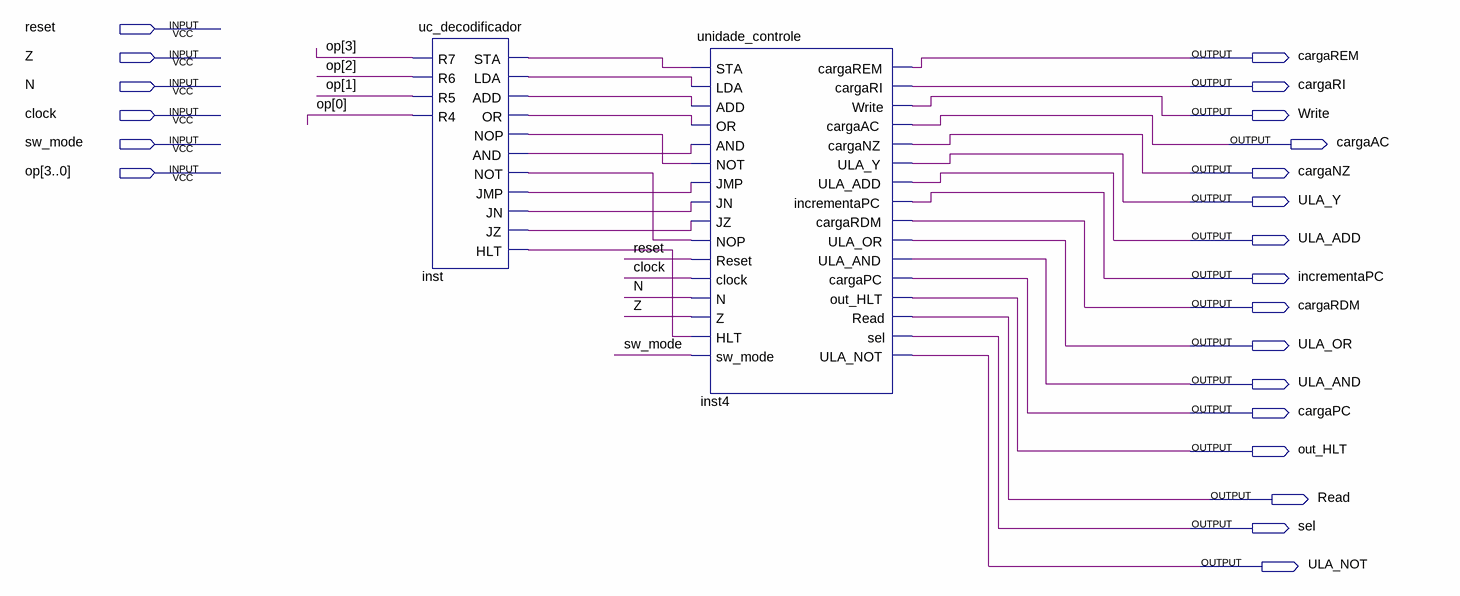
[diagram p0: schematic sheet]
// Quartus schematic lab_07.bdf as structural Verilog: 2 symbols, 22 pins
module lab_07 (
  input  reset,
  input  Z,
  input  N,
  input  clock,
  input  sw_mode,
  input  [3:0] op,
  output cargaREM,
  output cargaRI,
  output Write,
  output cargaAC,
  output cargaNZ,
  output ULA_Y,
  output ULA_ADD,
  output incrementaPC,
  output cargaRDM,
  output ULA_OR,
  output ULA_AND,
  output cargaPC,
  output out_HLT,
  output Read,
  output sel,
  output ULA_NOT
);

  wire inst_add, inst_and, inst_hlt, inst_jmp, inst_jn, inst_jz, inst_lda, inst_nop, inst_not, inst_or,
       inst_sta;

  uc_decodificador inst (
    .R7(op[3]), .R6(op[2]), .R5(op[1]), .R4(op[0]), .STA(inst_sta), .LDA(inst_lda), .ADD(inst_add),
    .OR(inst_or), .NOP(inst_nop), .AND(inst_and), .NOT(inst_not), .JMP(inst_jmp), .JN(inst_jn), .JZ(inst_jz),
    .HLT(inst_hlt));
  unidade_controle inst4 (
    .STA(inst_sta), .LDA(inst_lda), .ADD(inst_add), .OR(inst_or), .AND(inst_and), .NOT(inst_nop),
    .JMP(inst_jmp), .JN(inst_jn), .JZ(inst_jz), .NOP(inst_not), .Reset(reset), .clock(clock), .N(N), .Z(Z),
    .HLT(inst_hlt), .sw_mode(sw_mode), .cargaREM(cargaREM), .cargaRI(cargaRI), .Write(Write),
    .cargaAC(cargaAC), .cargaNZ(cargaNZ), .ULA_Y(ULA_Y), .ULA_ADD(ULA_ADD), .incrementaPC(incrementaPC),
    .cargaRDM(cargaRDM), .ULA_OR(ULA_OR), .ULA_AND(ULA_AND), .cargaPC(cargaPC), .out_HLT(out_HLT),
    .Read(Read), .sel(sel), .ULA_NOT(ULA_NOT));
endmodule
